# Altium schematic sheet DualColorLEDLighting-PCB 2.SchDoc
size A3; SheetNumber: 2; SheetTotal: 2
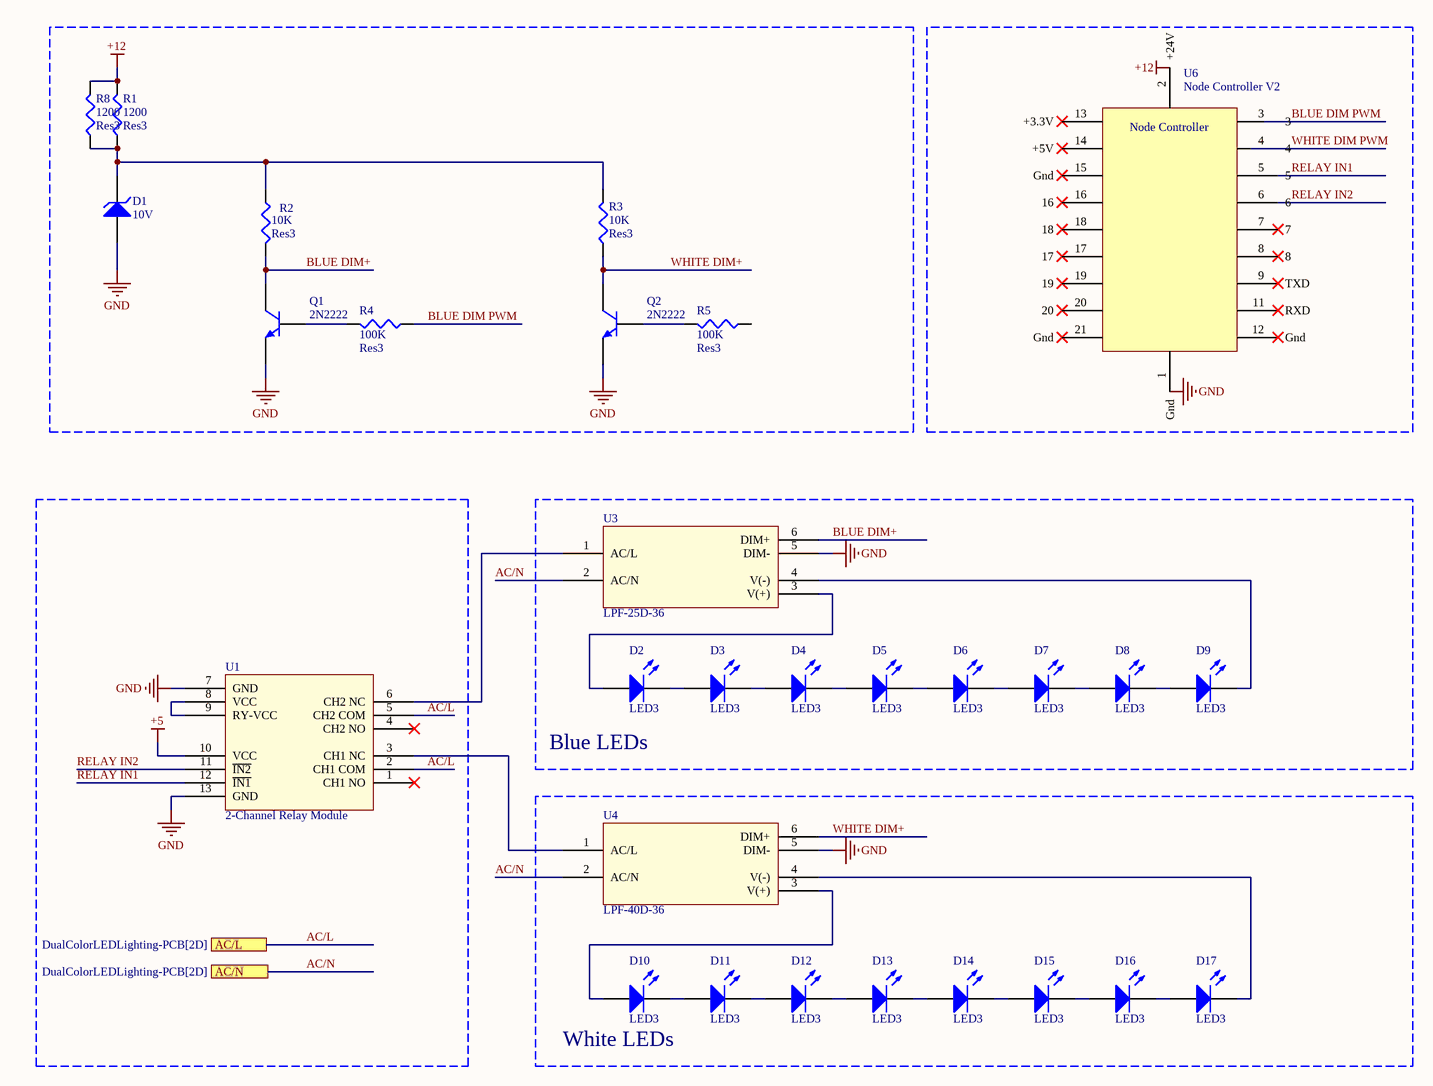
[diagram p0: DualColorLEDLighting-PCB 2.SchDoc]

## Parts
D1  10V  [DIODE-0.7]
D2  LED3  [3.5X2.8X1.9]
D3  LED3  [3.5X2.8X1.9]
D4  LED3  [3.5X2.8X1.9]
D5  LED3  [3.5X2.8X1.9]
D6  LED3  [3.5X2.8X1.9]
D7  LED3  [3.5X2.8X1.9]
D8  LED3  [3.5X2.8X1.9]
D9  LED3  [3.5X2.8X1.9]
D10  LED3  [3.5X2.8X1.9]
D11  LED3  [3.5X2.8X1.9]
D12  LED3  [3.5X2.8X1.9]
D13  LED3  [3.5X2.8X1.9]
D14  LED3  [3.5X2.8X1.9]
D15  LED3  [3.5X2.8X1.9]
D16  LED3  [3.5X2.8X1.9]
D17  LED3  [3.5X2.8X1.9]
Q1  2N2222  [TO-226-AA]
Q2  2N2222  [TO-226-AA]
R1  Res3  value 1200  [J1-0603]
R2  Res3  value 10K  [J1-0603]
R3  Res3  value 10K  [J1-0603]
R4  Res3  value 100K  [J1-0603]
R5  Res3  value 100K  [J1-0603]
R8  Res3  value 1200  [J1-0603]
U1  2-Channel Relay Module
U3  LPF-25D-36
U4  LPF-40D-36
U6  Node Controller V2

## Blocks framed on the sheet
Blue LEDs: D2-D9 U3
White LEDs: D10-D17 U4

## Ports
AC/L (see DualColorLEDLighting-PCB[2D]), AC/N (see DualColorLEDLighting-PCB[2D])

## Nets
+5: U1.10(VCC)
+12: R1.2 R8.2
GND: D1.1(A) Q1.3(E) Q2.3(E) U1.7(GND) U1.13(GND) U3.5(DIM-) U4.5(DIM-)
AC/L: U1.2(CH1_COM) U1.5(CH2_COM) ; port AC/L
AC/N: U3.2(AC/N) U4.2(AC/N) ; port AC/N
BLUE DIM PWM: R4.1
BLUE DIM+: Q1.1(C) R2.2 U3.6(DIM+)
RELAY IN1: U1.12(~{IN1})
RELAY IN2: U1.11(~{IN2})
WHITE DIM+: Q2.1(C) R3.1 U4.6(DIM+)
NetD1_2: D1.2(K) R1.1 R2.1 R3.2 R8.1
NetD2_1: D2.1(A) U3.3(V(+))
NetD2_2: D2.2(K) D3.1(A)
NetD3_2: D3.2(K) D4.1(A)
NetD4_2: D4.2(K) D5.1(A)
NetD5_2: D5.2(K) D6.1(A)
NetD6_2: D6.2(K) D7.1(A)
NetD7_2: D7.2(K) D8.1(A)
NetD8_2: D8.2(K) D9.1(A)
NetD9_2: D9.2(K) U3.4(V(-))
NetD10_1: D10.1(A) U4.3(V(+))
NetD10_2: D10.2(K) D11.1(A)
NetD11_2: D11.2(K) D12.1(A)
NetD12_2: D12.2(K) D13.1(A)
NetD13_2: D13.2(K) D14.1(A)
NetD14_2: D14.2(K) D15.1(A)
NetD15_2: D15.2(K) D16.1(A)
NetD16_2: D16.2(K) D17.1(A)
NetD17_2: D17.2(K) U4.4(V(-))
NetQ1_2: Q1.2(B) R4.2
NetQ2_2: Q2.2(B) R5.2
NetU1_3: U1.3(CH1_NC) U4.1(AC/L)
NetU1_6: U1.6(CH2_NC) U3.1(AC/L)
NetU1_8: U1.8(VCC) U1.9(RY-VCC)

Not connected (* = marked no-connect by the designer): R5 1; U1 1(CH1_NO)* 4(CH2_NO)*; U6 1(Gnd) 2(+24V) 3 4 5 6 7 8 9(TXD) 11(RXD) 12(Gnd) 13(+3.3V) 14(+5V) 15(Gnd) 16 17 18 19 20 21(Gnd)

## Notes on the sheet
- Labels drawn without touching a wire or pin: +12, GND
- (in symbol Node Controller V2) Node Controller

## Library data of the parts
D1 = D Zener: Zener Diode; Published: 8-Jun-2000; LatestRevisionDate: 17-Jul-2002; LatestRevisionNote: Re-released for DXP Platform.; PackageReference: DIODE-0.7; Publisher: Altium Limited; PackageDescription: Diode, Thru-Hole; 2 Leads; 0.7 in Pin Spacing
D2-D17 = LED3: Typical BLUE SiC LED; Published: 8-Jun-2000; LatestRevisionDate: 17-Dec-2003; LatestRevisionNote: PCB Footprint replaced.; DatasheetVersion: 16-Apr-2002; PackageVersion: 16-Apr-2002; PackageReference: 3.5X2.8X1.9; Publisher: Altium Limited; PackageDescription: SM LED; 2 C-Bend Leads; Body 3.5 x 2.8 x 1.9 mm, inc leads (LxWxH typ)
Q1 Q2 = NPN: NPN Bipolar Transistor; Published: 8-Jun-2000; LatestRevisionDate: 17-Jul-2002; LatestRevisionNote: Re-released for DXP Platform.; PackageReference: TO-226-AA; Publisher: Altium Limited; PackageDescription: TO, Flat Index; 3 In-Line, Axial Leads; Body Dia. 4.8mm; Leads 0.55 x 0.51 mm (max); Code_JEDEC: TO-226-AA
R1-R5 R8 = Res3: Resistor; Published: 8-Jun-2000; LatestRevisionDate: 29-May-2009; LatestRevisionNote: IPC-7351 Footprint Added.; PackageReference: J1-0603; Publisher: Altium Limited; PackageDescription: Chip Resistor
U1 = 2-Channel Relay Module: 2-Channel Relay Module for Arduino & Raspberry Pi - 5V
U3 = LPF-25D-36: LED DRVR CC AC/DC 19.8-36V 700MA
U4 = LPF-40D-36: LED DRVR CC AC/DC 21.6-36V 1.12A